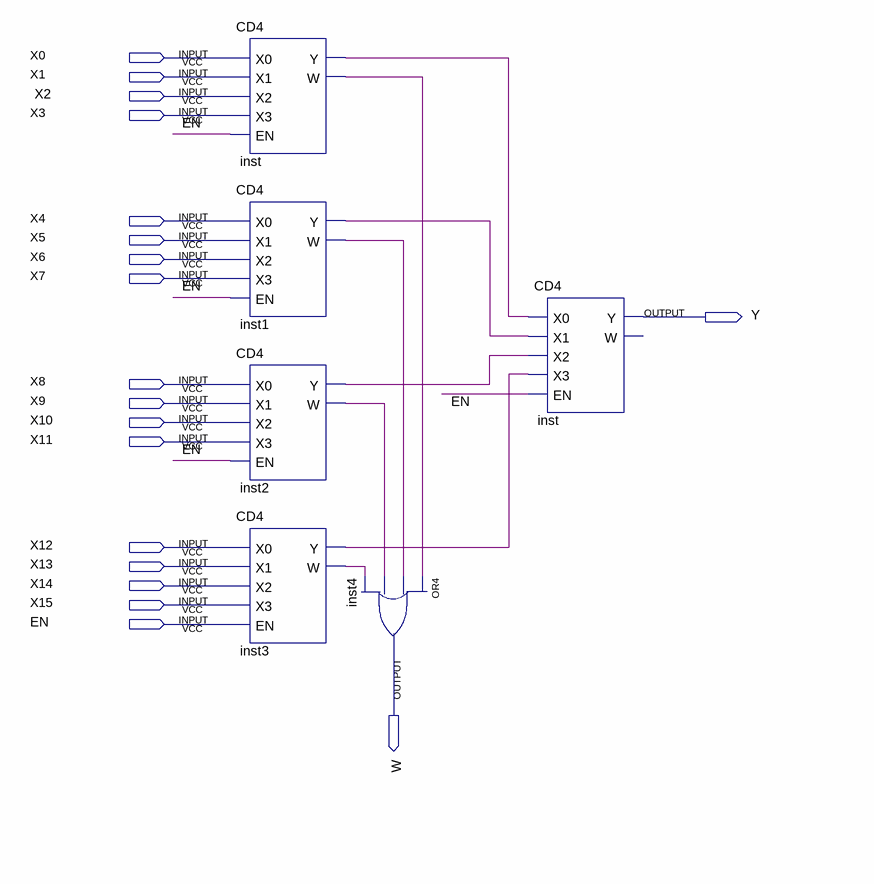
[diagram p0: schematic sheet]
// Quartus schematic CD16.bdf as structural Verilog: 6 symbols, 19 pins
module CD16 (
  input  X0,
  input  X1,
  input  X2,
  input  X3,
  input  X4,
  input  X5,
  input  X6,
  input  X7,
  input  X8,
  input  X9,
  input  X10,
  input  X11,
  input  X12,
  input  X13,
  input  X14,
  input  X15,
  input  EN,
  output Y,
  output W
);

  wire inst1_w, inst1_y, inst2_w, inst2_y, inst3_w, inst3_y, inst_w, inst_y;

  CD4 inst (.X0(X0), .X1(X1), .X2(X2), .X3(X3), .EN(EN), .Y(inst_y), .W(inst_w));
  CD4 inst1 (.X0(X4), .X1(X5), .X2(X6), .X3(X7), .EN(EN), .Y(inst1_y), .W(inst1_w));
  CD4 inst2 (.X0(X8), .X1(X9), .X2(X10), .X3(X11), .EN(EN), .Y(inst2_y), .W(inst2_w));
  CD4 inst3 (.X0(X12), .X1(X13), .X2(X14), .X3(X15), .EN(EN), .Y(inst3_y), .W(inst3_w));
  or inst4 (W, inst_w, inst1_w, inst2_w, inst3_w);
  CD4 inst_dup2 (.X0(inst_y), .X1(inst1_y), .X2(inst2_y), .X3(inst3_y), .EN(EN), .Y(Y));  // open: W
endmodule
